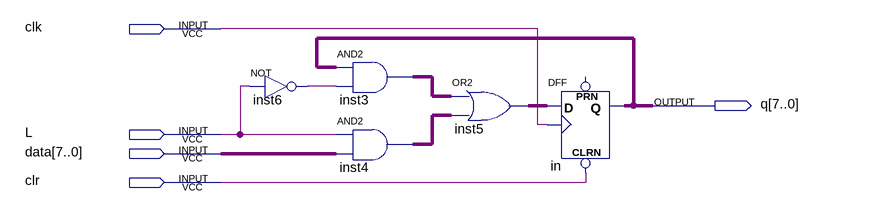
[diagram p0: schematic sheet]
// Quartus schematic reg.bdf as structural Verilog: 5 symbols, 5 pins
module \reg  (
  input  clk,
  input  L,
  input  [7:0] data,
  input  clr,
  output [7:0] q
);

  wire inst6_out;
  wire [7:0] inst3_out, inst4_out, inst5_out;

  not inst6 (inst6_out, L);
  assign inst3_out = q & {8{inst6_out}};  // AND2 inst3, 8 bits wide
  assign inst4_out = {8{L}} & data;  // AND2 inst4, 8 bits wide
  assign inst5_out = inst3_out | inst4_out;  // OR2 inst5, 8 bits wide
  DFF in[7:0] (.CLRN(clr), .CLK(clk), .D(inst5_out), .Q(q));  // open: PRN
endmodule
